# Altium schematic sheet 11_CONNECTOR.SchDoc
size 297 x 209 mm
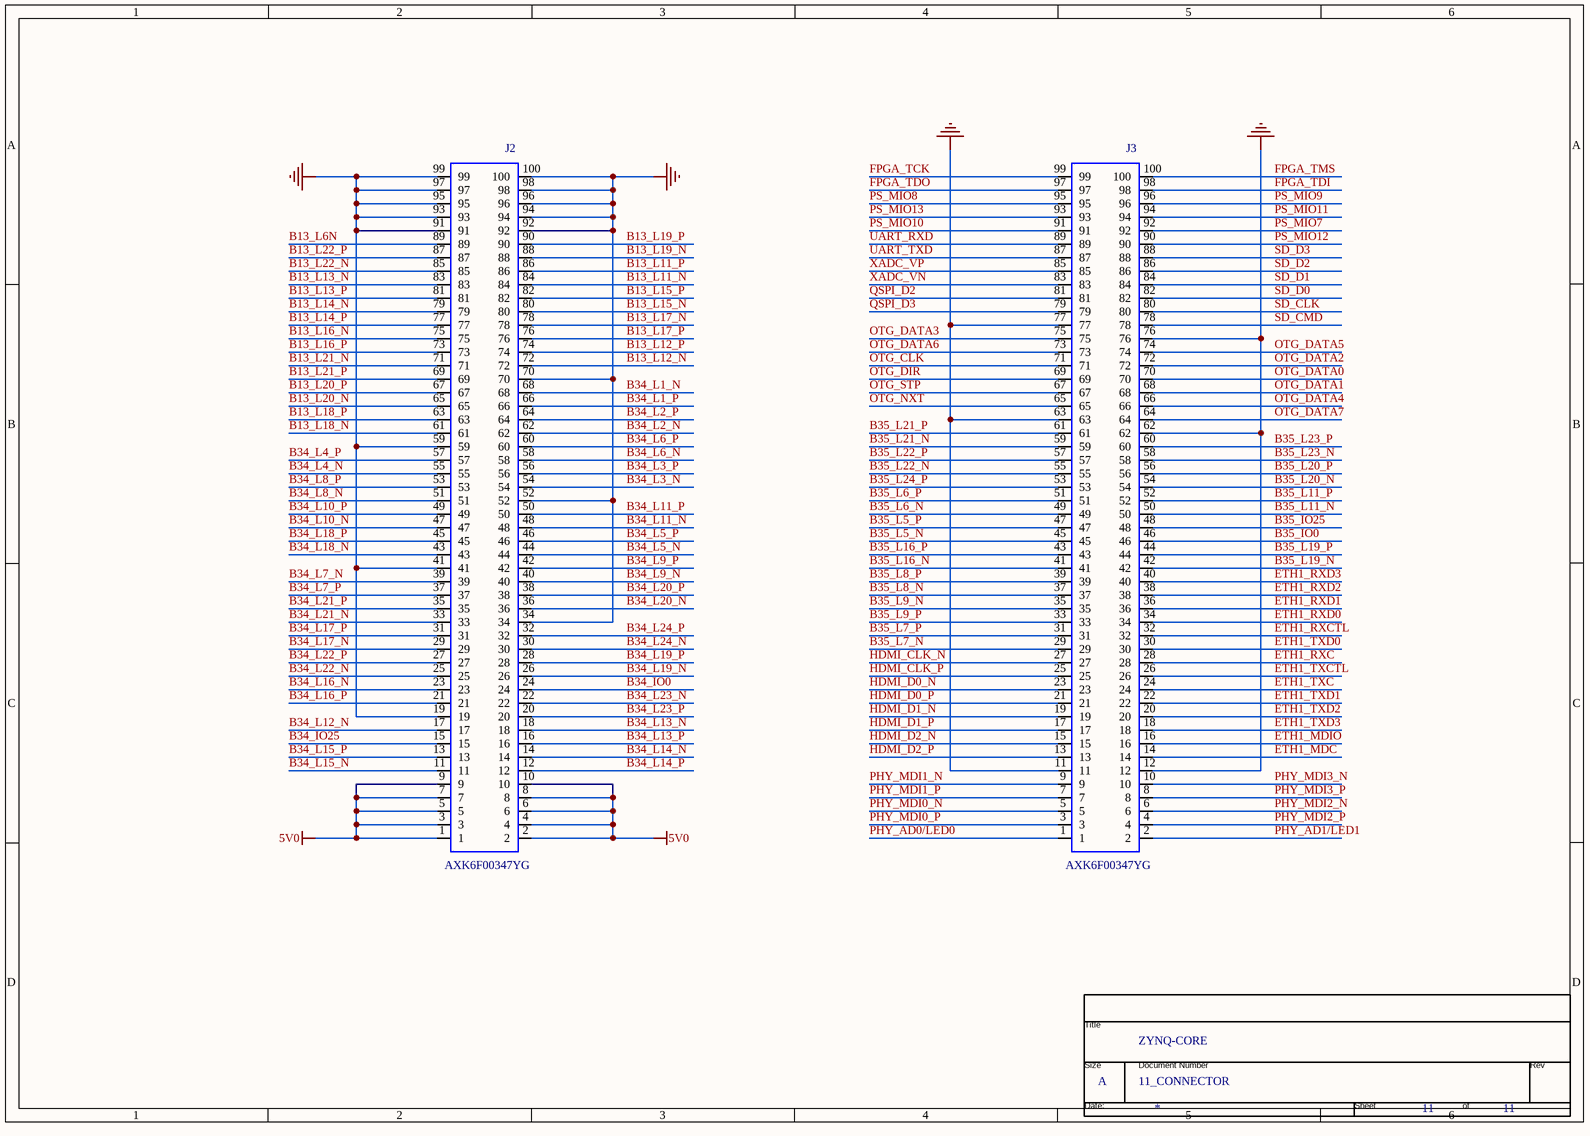
[diagram p0: 11_CONNECTOR.SchDoc]

## Parts
*  Page Count: 11  Page Size: A  Title: ZYNQ-CORE  Doc: 11_CONNECTOR  (hidden comment: TitleBlock0)  (graphical)
J2  AXK6F00347YG  [AXK6F00347YG_V]
J3  AXK6F00347YG  [AXK6F00347YG_V]

## Nets
5V0: J2.1 J2.2 J2.3 J2.4 J2.5 J2.6 J2.7 J2.8 J2.9 J2.10
GND: J2.19 J2.34 J2.41 J2.52 J2.59 J2.70 J2.91 J2.92 J2.93 J2.94 J2.95 J2.96 J2.97 J2.98 J2.99 J2.100 J3.11 J3.12 J3.62 J3.63 J3.76 J3.77
B13_L6N: J2.89
B13_L11_N: J2.84
B13_L11_P: J2.86
B13_L12_N: J2.72
B13_L12_P: J2.74
B13_L13_N: J2.83
B13_L13_P: J2.81
B13_L14_N: J2.79
B13_L14_P: J2.77
B13_L15_N: J2.80
B13_L15_P: J2.82
B13_L16_N: J2.75
B13_L16_P: J2.73
B13_L17_N: J2.78
B13_L17_P: J2.76
B13_L18_N: J2.61
B13_L18_P: J2.63
B13_L19_N: J2.88
B13_L19_P: J2.90
B13_L20_N: J2.65
B13_L20_P: J2.67
B13_L21_N: J2.71
B13_L21_P: J2.69
B13_L22_N: J2.85
B13_L22_P: J2.87
B34_IO0: J2.24
B34_IO25: J2.15
B34_L1_N: J2.68
B34_L1_P: J2.66
B34_L2_N: J2.62
B34_L2_P: J2.64
B34_L3_N: J2.54
B34_L3_P: J2.56
B34_L4_N: J2.55
B34_L4_P: J2.57
B34_L5_N: J2.44
B34_L5_P: J2.46
B34_L6_N: J2.58
B34_L6_P: J2.60
B34_L7_N: J2.39
B34_L7_P: J2.37
B34_L8_N: J2.51
B34_L8_P: J2.53
B34_L9_N: J2.40
B34_L9_P: J2.42
B34_L10_N: J2.47
B34_L10_P: J2.49
B34_L11_N: J2.48
B34_L11_P: J2.50
B34_L12_N: J2.17
B34_L13_N: J2.18
B34_L13_P: J2.16
B34_L14_N: J2.14
B34_L14_P: J2.12
B34_L15_N: J2.11
B34_L15_P: J2.13
B34_L16_N: J2.23
B34_L16_P: J2.21
B34_L17_N: J2.29
B34_L17_P: J2.31
B34_L18_N: J2.43
B34_L18_P: J2.45
B34_L19_N: J2.26
B34_L19_P: J2.28
B34_L20_N: J2.36
B34_L20_P: J2.38
B34_L21_N: J2.33
B34_L21_P: J2.35
B34_L22_N: J2.25
B34_L22_P: J2.27
B34_L23_N: J2.22
B34_L23_P: J2.20
B34_L24_N: J2.30
B34_L24_P: J2.32
B35_IO0: J3.46
B35_IO25: J3.48
B35_L5_N: J3.45
B35_L5_P: J3.47
B35_L6_N: J3.49
B35_L6_P: J3.51
B35_L7_N: J3.29
B35_L7_P: J3.31
B35_L8_N: J3.37
B35_L8_P: J3.39
B35_L9_N: J3.35
B35_L9_P: J3.33
B35_L11_N: J3.50
B35_L11_P: J3.52
B35_L16_N: J3.41
B35_L16_P: J3.43
B35_L19_N: J3.42
B35_L19_P: J3.44
B35_L20_N: J3.54
B35_L20_P: J3.56
B35_L21_N: J3.59
B35_L21_P: J3.61
B35_L22_N: J3.55
B35_L22_P: J3.57
B35_L23_N: J3.58
B35_L23_P: J3.60
B35_L24_P: J3.53
ETH1_MDC: J3.14
ETH1_MDIO: J3.16
ETH1_RXC: J3.28
ETH1_RXCTL: J3.32
ETH1_RXD0: J3.34
ETH1_RXD1: J3.36
ETH1_RXD2: J3.38
ETH1_RXD3: J3.40
ETH1_TXC: J3.24
ETH1_TXCTL: J3.26
ETH1_TXD0: J3.30
ETH1_TXD1: J3.22
ETH1_TXD2: J3.20
ETH1_TXD3: J3.18
FPGA_TCK: J3.99
FPGA_TDI: J3.98
FPGA_TDO: J3.97
FPGA_TMS: J3.100
HDMI_CLK_N: J3.27
HDMI_CLK_P: J3.25
HDMI_D0_N: J3.23
HDMI_D0_P: J3.21
HDMI_D1_N: J3.19
HDMI_D1_P: J3.17
HDMI_D2_N: J3.15
HDMI_D2_P: J3.13
OTG_CLK: J3.71
OTG_DATA0: J3.70
OTG_DATA1: J3.68
OTG_DATA2: J3.72
OTG_DATA3: J3.75
OTG_DATA4: J3.66
OTG_DATA5: J3.74
OTG_DATA6: J3.73
OTG_DATA7: J3.64
OTG_DIR: J3.69
OTG_NXT: J3.65
OTG_STP: J3.67
PHY_AD0/LED0: J3.1
PHY_AD1/LED1: J3.2
PHY_MDI0_N: J3.5
PHY_MDI0_P: J3.3
PHY_MDI1_N: J3.9
PHY_MDI1_P: J3.7
PHY_MDI2_N: J3.6
PHY_MDI2_P: J3.4
PHY_MDI3_N: J3.10
PHY_MDI3_P: J3.8
PS_MIO7: J3.92
PS_MIO8: J3.95
PS_MIO9: J3.96
PS_MIO10: J3.91
PS_MIO11: J3.94
PS_MIO12: J3.90
PS_MIO13: J3.93
QSPI_D2: J3.81
QSPI_D3: J3.79
SD_CLK: J3.80
SD_CMD: J3.78
SD_D0: J3.82
SD_D1: J3.84
SD_D2: J3.86
SD_D3: J3.88
UART_RXD: J3.89
UART_TXD: J3.87
XADC_VN: J3.83
XADC_VP: J3.85

## Notes on the sheet
- (in symbol TitleBlock0) Title; Size; Document Number; Rev; Date:; Sheet; of

## Library data of the parts
J2 J3 = Header_2X50: Header_2X50_0.5mm; PCB Footprint: H0_8X2X50_B
* = TitleBlock0: Page Number: 11; Page Create Date: March  8, 1995; Page Modify Date: *